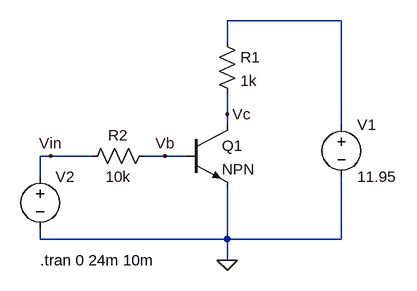
[diagram p0: schematic lab4_1.asc]
lab4_1.asc, the LTspice schematic file:
Version 4
SHEET 1 880 680
WIRE 544 -128 368 -128
WIRE 368 -96 368 -128
WIRE 368 16 368 -16
WIRE 368 32 368 16
WIRE 544 32 544 -128
WIRE 96 80 80 80
WIRE 160 80 96 80
WIRE 272 80 240 80
WIRE 304 80 272 80
WIRE 80 112 80 80
WIRE 80 208 80 192
WIRE 368 208 368 128
WIRE 368 208 80 208
WIRE 544 208 544 112
WIRE 544 208 368 208
WIRE 368 240 368 208
FLAG 368 240 0
FLAG 272 80 Vb
FLAG 368 16 Vc
FLAG 96 80 Vin
SYMBOL voltage 80 96 R0
WINDOW 3 24 96 Invisible 2
WINDOW 123 0 0 Left 0
WINDOW 39 0 0 Left 0
SYMATTR Value PULSE(0 5 10e-3 10e-3 10e-3 10e-3 30e-3)
SYMATTR InstName V2
SYMBOL res 144 96 R270
WINDOW 0 32 56 VTop 2
WINDOW 3 0 56 VBottom 2
SYMATTR InstName R2
SYMATTR Value 10k
SYMBOL res 352 -112 R0
SYMATTR InstName R1
SYMATTR Value 1k
SYMBOL voltage 544 16 R0
WINDOW 123 0 0 Left 0
WINDOW 39 0 0 Left 0
SYMATTR InstName V1
SYMATTR Value 11.95
SYMBOL npn 304 32 R0
SYMATTR InstName Q1
TEXT 80 240 Left 2 !.tran 0 24m 10m

The netlist it stands for:
* lab4_1.asc
V2 Vin 0 PULSE(0 5 10e-3 10e-3 10e-3 10e-3 30e-3)
R2 Vin Vb 10k
R1 N001 Vc 1k
V1 N001 0 11.95
Q1 Vc Vb 0 0 NPN
.model NPN NPN
.model PNP PNP
.lib standard.bjt
.tran 0 24m 10m
.backanno
.end